# EAGLE design base-6u-db-protected-input (EAGLE 5.06)
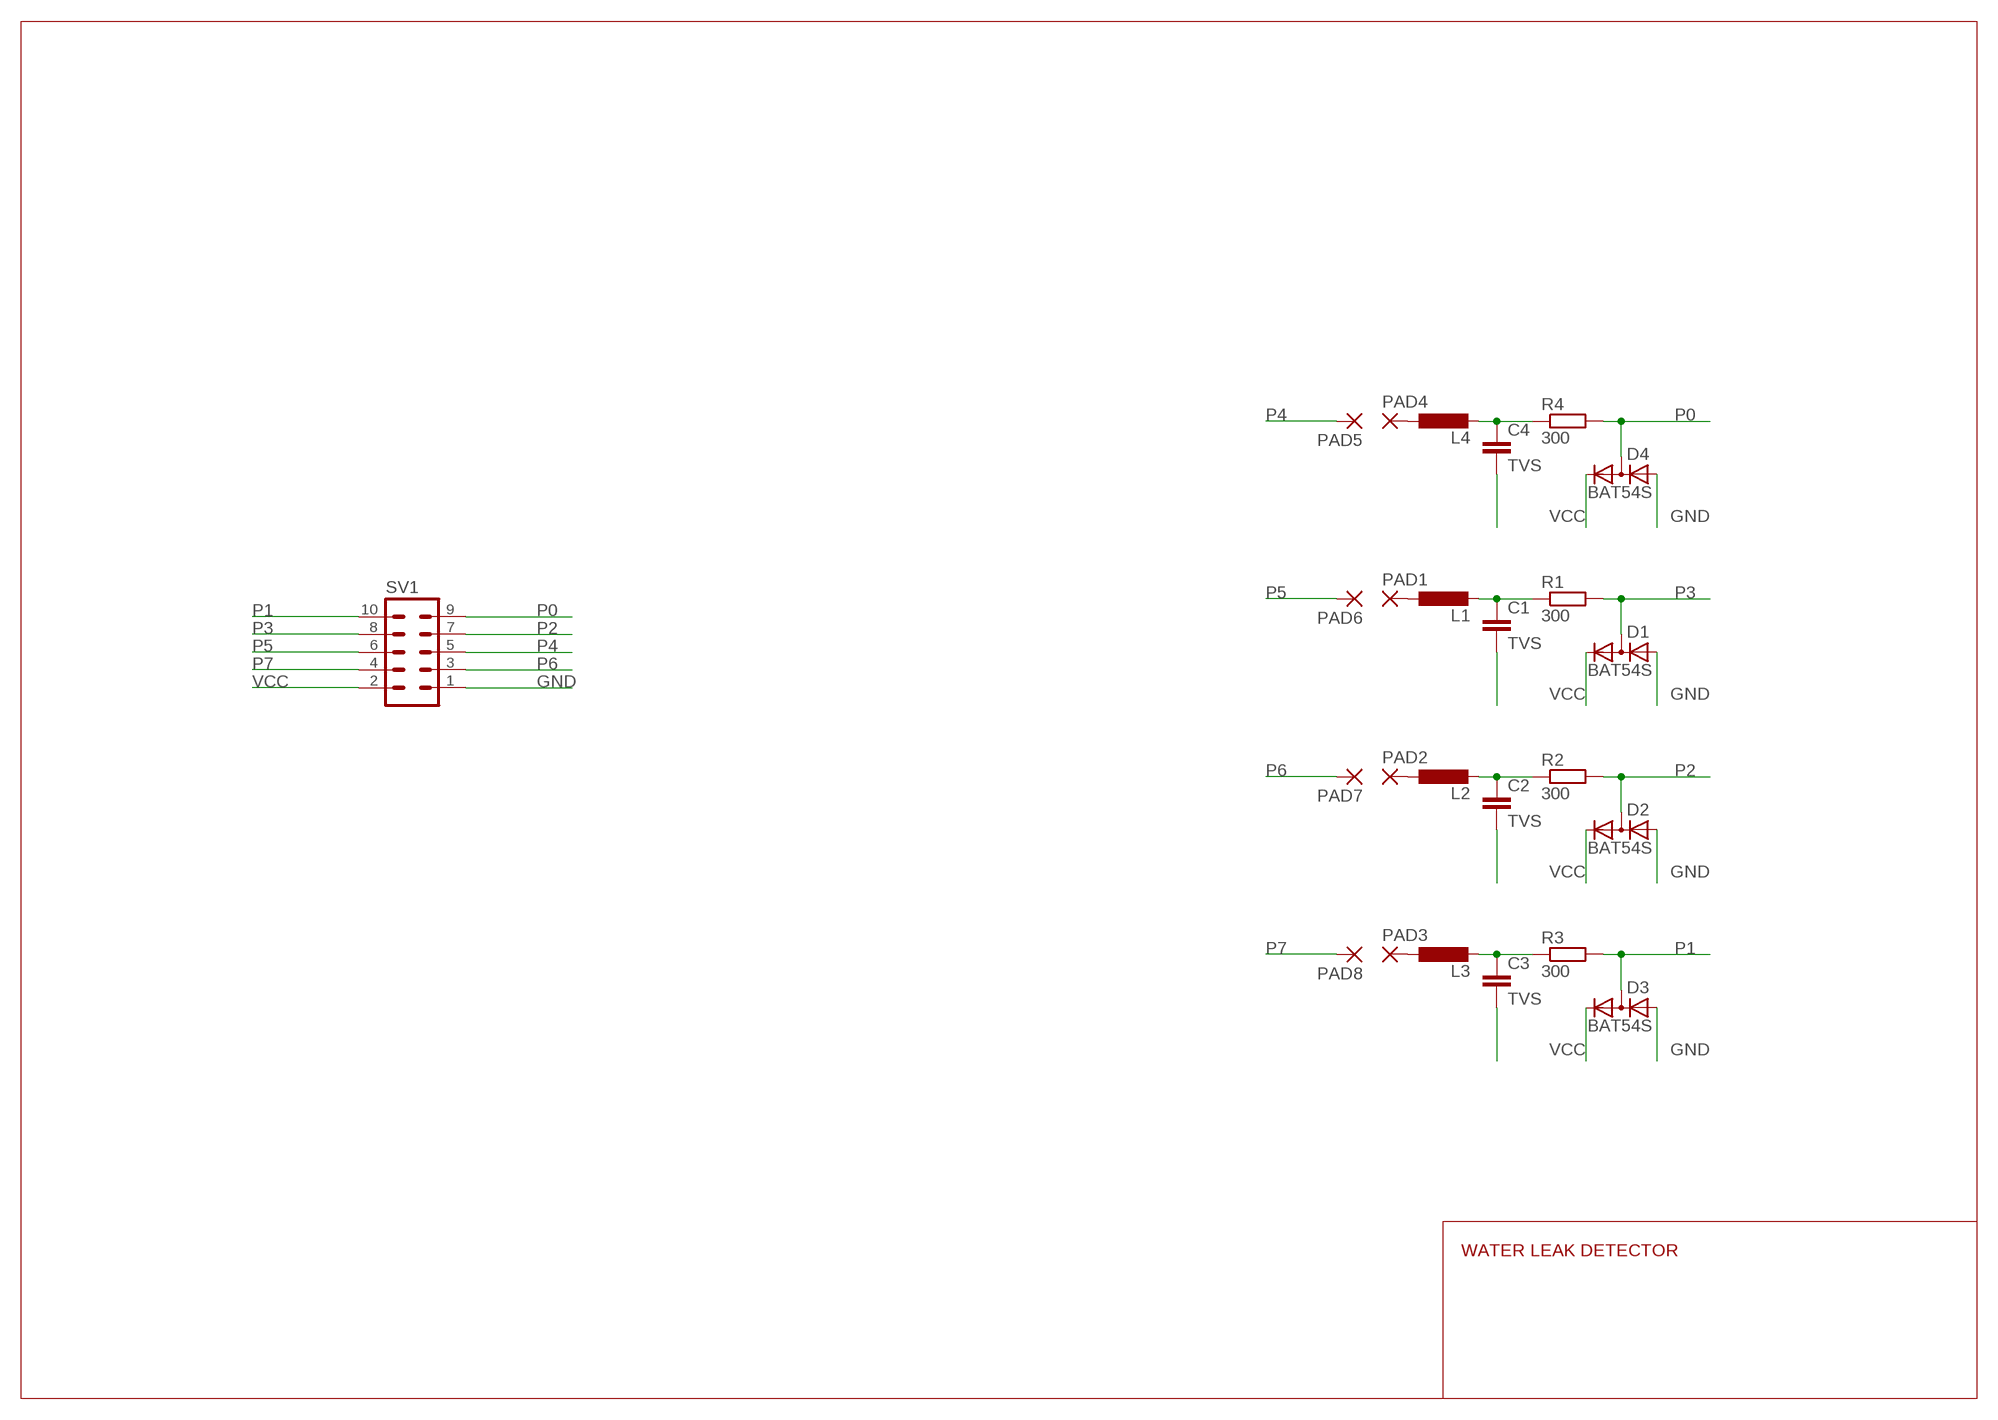
[diagram p0: schematic, sheet 1]

## Parts
C1  TVS  C-EUC1210  [C1210]
C2  TVS  C-EUC1210  [C1210]
C3  TVS  C-EUC1210  [C1210]
C4  TVS  C-EUC1210  [C1210]
D1  BAT54S  DIODE_2CACA-SOT23  [SOT23]
D2  BAT54S  DIODE_2CACA-SOT23  [SOT23]
D3  BAT54S  DIODE_2CACA-SOT23  [SOT23]
D4  BAT54S  DIODE_2CACA-SOT23  [SOT23]
L1  L-EU0204/7  [0204/7]
L2  L-EU0204/7  [0204/7]
L3  L-EU0204/7  [0204/7]
L4  L-EU0204/7  [0204/7]
PAD1  2,15/1,0  [2,15/1,0]
PAD2  2,15/1,0  [2,15/1,0]
PAD3  2,15/1,0  [2,15/1,0]
PAD4  2,15/1,0  [2,15/1,0]
PAD5  2,15/1,0  [2,15/1,0]
PAD6  2,15/1,0  [2,15/1,0]
PAD7  2,15/1,0  [2,15/1,0]
PAD8  2,15/1,0  [2,15/1,0]
R1  300  R-EU_R0805  [R0805]
R2  300  R-EU_R0805  [R0805]
R3  300  R-EU_R0805  [R0805]
R4  300  R-EU_R0805  [R0805]
SV1  MA05-2  [MA05-2]

## Nets
GND: C1.2 C2.2 C3.2 C4.2 D1.1(A) D2.1(A) D3.1(A) D4.1(A) SV1.1
N$1: C1.1 L1.2 R1.1
N$2: L1.1 PAD1.1(P)
N$3: C2.1 L2.2 R2.1
N$4: L2.1 PAD2.1(P)
N$5: C3.1 L3.2 R3.1
N$6: L3.1 PAD3.1(P)
N$7: C4.1 L4.2 R4.1
N$8: L4.1 PAD4.1(P)
P0: D4.3(AC) R4.2 SV1.9
P1: D3.3(AC) R3.2 SV1.10
P2: D2.3(AC) R2.2 SV1.7
P3: D1.3(AC) R1.2 SV1.8
P4: PAD5.1(P) SV1.5
P5: PAD6.1(P) SV1.6
P6: PAD7.1(P) SV1.3
P7: PAD8.1(P) SV1.4
VCC: D1.2(C) D2.2(C) D3.2(C) D4.2(C) SV1.2

## Notes on the sheet
- WATER LEAK DETECTOR

## Library data of the parts
C1-C4 = rcl:C-EU: CAPACITOR, European symbol
D1-D4 = diode:DIODE_2CACA-: 2 Diodes - Cathode-Anode|Cathode-Anode
L1-L4 = resistor:L-EU: INDUCTOR, European symbol
PAD1-PAD8 = wirepad:2,15/1,0: THROUGH-HOLE PAD
R1-R4 = resistor:R-EU_: RESISTOR, European symbol
SV1 = con-lstb:MA05-2: PIN HEADER

## Net classes
1 thin: width 0.254 mm
2 z: width 0.127 mm

## Board
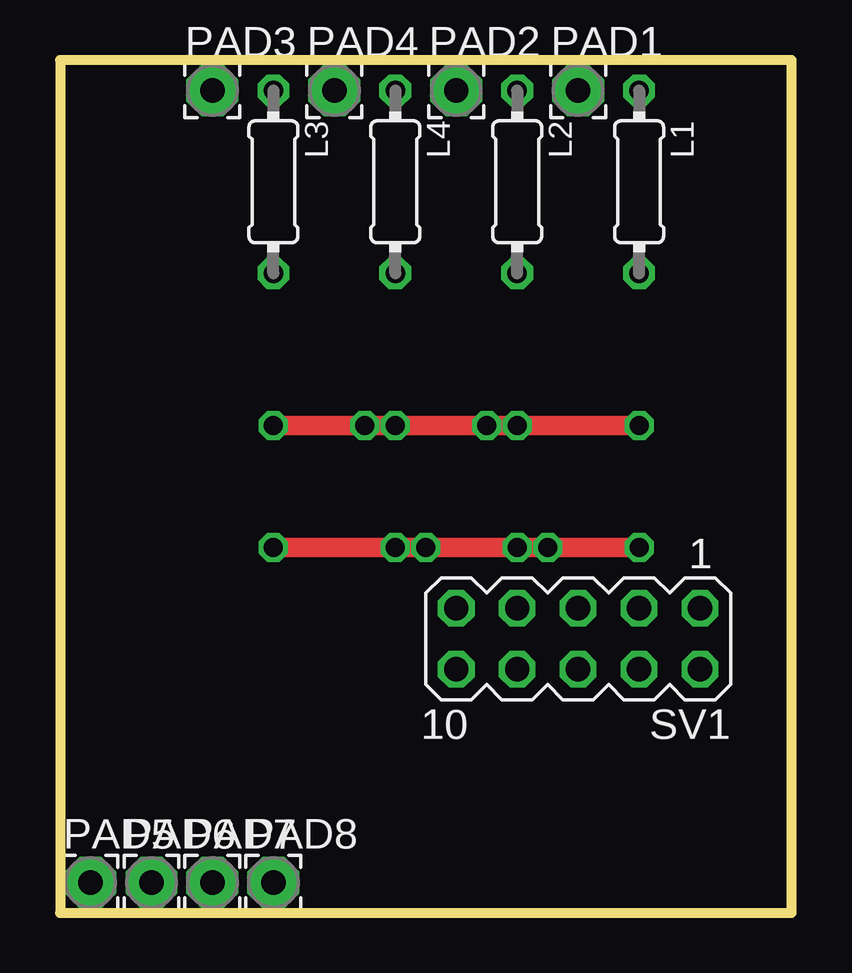
[diagram p1: board, top side]
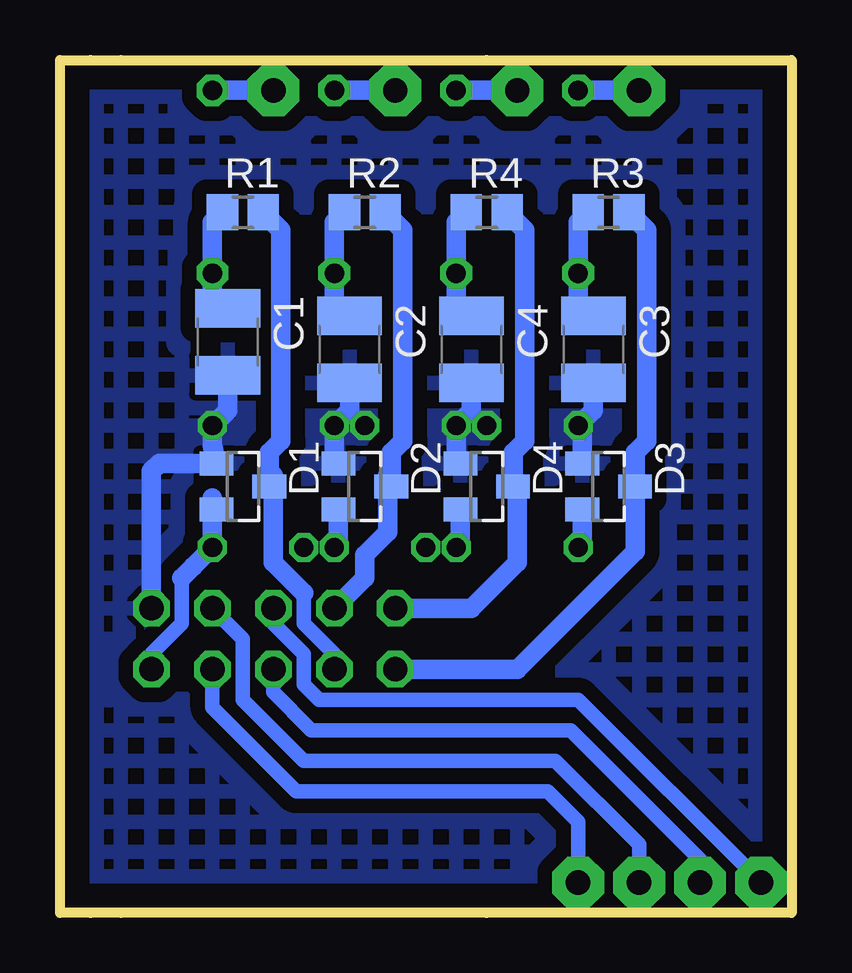
[diagram p2: board, bottom side, seen from below]

Size 30.48 x 35.56 mm. Coordinates in mm from the lower left corner, seen from the top.
Outline: 27.94,0 12.7,0 0,0 0,35.56 12.7,35.56 27.94,35.56 29.21,35.56 30.48,35.56 30.48,0 27.94,0
Outline: 27.94,0 29.21,0
Copper layers (1*16): Top 0.035mm / dielectric 1.5mm / Bottom 0.035mm
Design rules "default": minimum track width 10mil, minimum drill 24mil, track to track 8mil, track to pad 8mil, pad to pad 8mil, via to via 8mil, smd to smd 8mil, copper to edge 40mil, drill to drill 8mil, minimum pad ring 10mil, minimum via ring 8mil, stop-mask expansion 4mil, vias tented up to drill 0mil, thermal gap 10mil

### Footprints (pad centres in the part's own frame; a part is rotated, then mirrored left to right if it is on the bottom)
C1210 = smd 1.6 x 2.7: 1 -1.4,0; 2 1.4,0
SOT23 = smd 1 x 1.4: 1 -0.95,-1.1; 2 0.95,-1.1; 3 0,1.1
0204/7 = drill 0.813 octagon: 1 -3.81,0; 2 3.81,0
2,15/1,0 = drill 1.016 pad 2.159 octagon: 1 0,0
R0805 = smd 1.3 x 1.5: 1 -0.85,0; 2 0.85,0
MA05-2 = drill 1.016 octagon: 1 -5.08,-1.27; 2 -5.08,1.27; 3 -2.54,-1.27; 4 -2.54,1.27; 5 0,-1.27; 6 0,1.27; 7 2.54,-1.27; 8 2.54,1.27; 9 5.08,-1.27; 10 5.08,1.27

### Placement (x,y rotation side)
C1  23.49,23.81 270 bottom
C2  18.41,23.5 270 bottom
C3  8.26,23.5 270 bottom
C4  13.33,23.5 270 bottom
D1  22.86,17.78 270 bottom
D2  17.78,17.78 270 bottom
D3  7.62,17.78 270 bottom
D4  12.7,17.78 270 bottom
L1  24.13,30.48 270 top
L2  19.05,30.48 270 top
L3  8.89,30.48 270 top
L4  13.97,30.48 270 top
PAD1  21.59,34.29 0 top
PAD2  16.51,34.29 0 top
PAD3  6.35,34.29 0 top
PAD4  11.43,34.29 0 top
PAD5  1.27,1.27 0 top
PAD6  3.81,1.27 0 top
PAD7  6.35,1.27 0 top
PAD8  8.89,1.27 0 top
R1  22.86,29.21 0 bottom
R2  17.78,29.21 0 bottom
R3  7.62,29.21 0 bottom
R4  12.7,29.21 0 bottom
SV1  21.59,11.43 180 top

### Tracks (layer width: path | path; a pad name or v marks a point on that pad's centre or on a via)
GND  (via drill 0.8)
  Top 0.813: v24.13,20.32 22.86,20.32 v19.05,20.32 v17.78,20.32 v13.97,20.32 v12.7,20.32 v8.89,20.32
  Bottom 0.813: SV1.1 26.67,18.41 26.35,18.73 D1.1 24.13,19.54 v24.13,20.32 23.49,20.95 C1.2 | C2.2 18.41,20.95 v19.05,20.32 19.05,18.9 D2.1 | C4.2 13.33,20.95 v13.97,20.32 13.97,18.9 D4.1 | D3.1 8.72,20.15 v8.89,20.32 8.26,20.95 C3.2
  pour Bottom (isolate 0.61, hatched): 0,0 30.48,0 30.48,35.56 0,35.56
N$1
  Bottom 0.813: C1.1 24.13,24.89 L1.2 24.13,28.79 R1.1
N$2
  Bottom 0.813: PAD1.1 L1.1
N$3
  Bottom 0.813: R2.1 19.05,28.79 L2.2 19.05,25.53 C2.1
N$4
  Bottom 0.813: PAD2.1 L2.1
N$5
  Bottom 0.813: R3.1 8.89,28.79 L3.2 8.89,25.53 C3.1
N$6
  Bottom 0.813: PAD3.1 L3.1
N$7
  Bottom 0.813: R4.1 13.97,28.79 L4.2 13.97,25.53 C4.1
N$8
  Bottom 0.813: PAD4.1 L4.1
P0
  Bottom 0.813: SV1.9 13.33,12.7 11.43,14.61 11.43,17.61 D4.3 11.6,19.2 11.11,19.68 11.11,28.47 R4.2
P1
  Bottom 0.813: R3.2 6.03,28.47 6.03,19.68 6.52,19.2 D3.3 6.52,15.07 11.43,10.16 SV1.10
P2
  Bottom 0.813: SV1.7 17.78,13.97 17.78,14.92 16.83,15.88 16.83,18.27 D2.3 16.68,19.2 16.19,19.68 16.19,28.47 R2.2
P3
  Bottom 0.61: 20.32,13.34 20.32,12.06 19.05,10.79 SV1.8
  Bottom 0.813: R1.2 21.27,28.47 21.27,19.68 21.76,19.2 D1.3 21.59,18.25 21.59,14.61 20.32,13.34
P4
  Bottom 0.61: SV1.5 21.59,12.06 20.32,10.79 20.32,9.53 19.69,8.89 8.89,8.89 PAD5.1
P5
  Bottom 0.61: SV1.6 21.59,9.21 20,7.62 9.21,7.62 3.81,2.22 PAD6.1
P6
  Bottom 0.61: SV1.3 22.86,11.43 22.86,8.89 20.32,6.35 9.84,6.35 6.35,2.86 PAD7.1
P7
  Bottom 0.61: SV1.4 24.13,8.57 20.64,5.08 10.16,5.08 8.89,3.81 PAD8.1
VCC  (via drill 0.8)
  Top 0.813: v24.13,15.24 v20.32,15.24 v19.05,15.24 v15.24,15.24 v13.97,15.24 10.16,15.24 v8.89,15.24
  Bottom 0.61: 25.4,13.97 25.4,12.06 26.67,10.79 SV1.2
  Bottom 0.813: 24.92,14.45 25.4,13.97 | v24.13,15.24 24.92,14.45 | v24.13,15.24 24.13,17.3 D1.2 | D2.2 18.88,15.41 v19.05,15.24 | v24.13,15.24 24.92,14.45 | D4.2 13.8,15.41 v13.97,15.24 | D3.2 8.72,15.41 v8.89,15.24